# EAGLE design sensors Layer final (EAGLE 6.1)
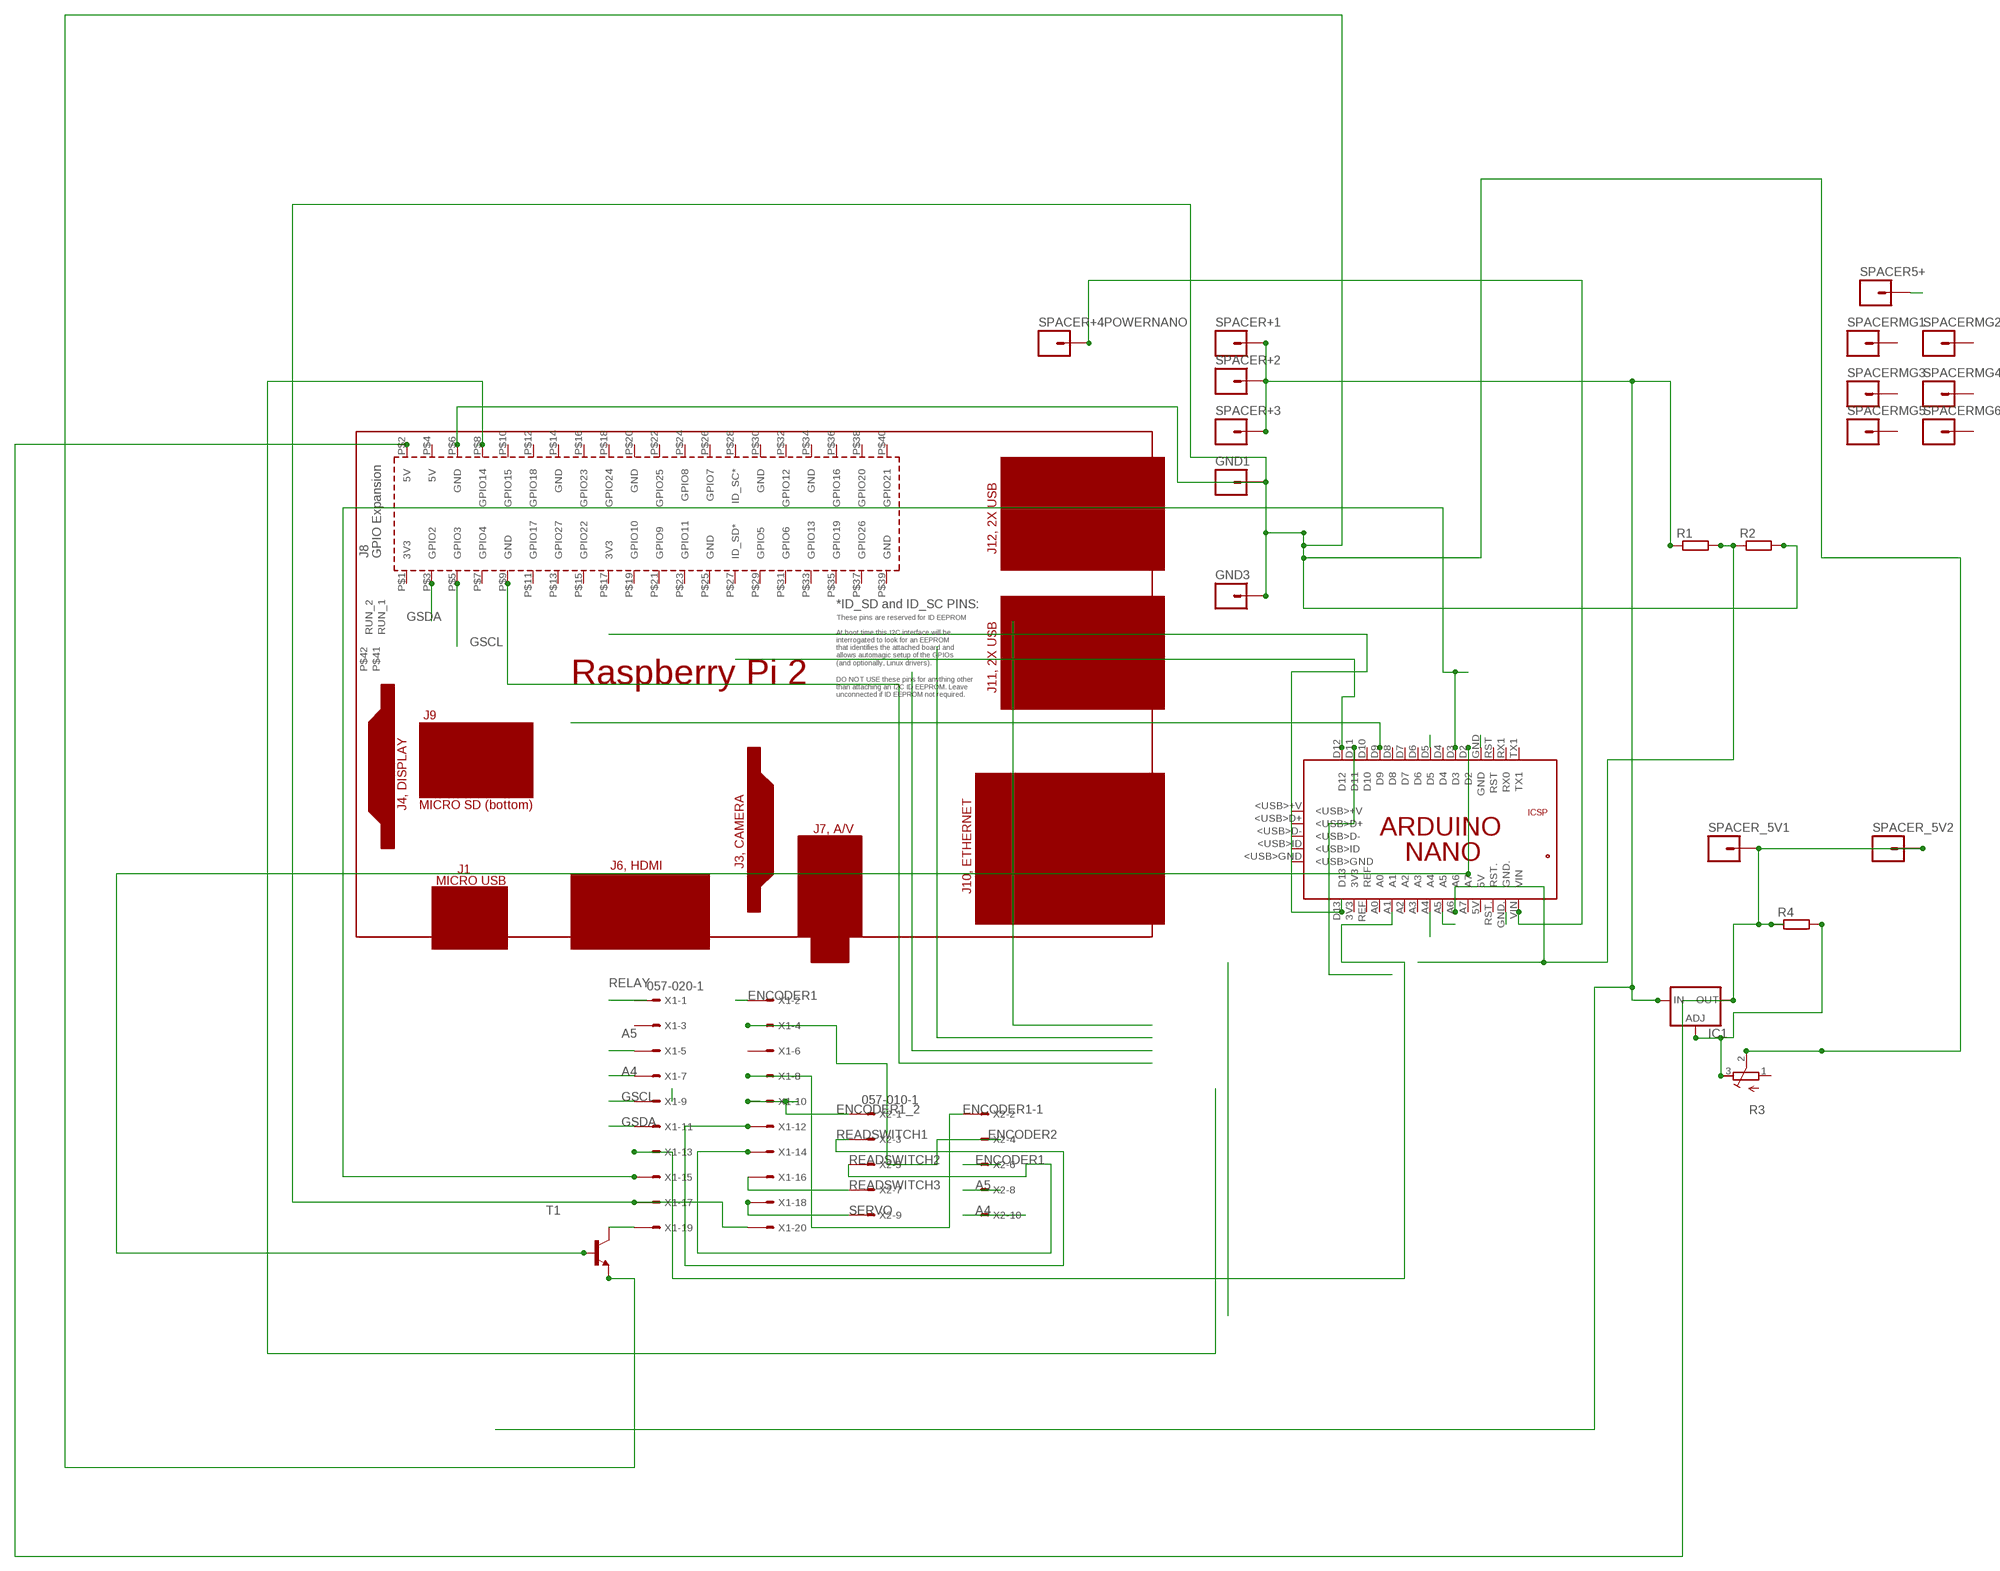
[diagram p0: schematic, sheet 1]

## Parts
GND1  M01PTH_2MM  [1X01_2MM]
GND3  M01PTH_2MM  [1X01_2MM]
IC1  LM138-TO3  [TO3-K02]
PCB1  RPI2  [RPI2]
PCB2  ARDUINO_NANO  [ARDUINO_NANO]
R1  R-EU_0207/10  [0207/10]
R2  R-EU_0207/10  [0207/10]
R3  R-TRIMM64W  [RTRIM64W]
R4  R-EU_0207/10  [0207/10]
SPACER5+  M01PTH_2MM  [1X01_2MM]
SPACER+1  M01PTH_2MM  [1X01_2MM]
SPACER+2  M01PTH_2MM  [1X01_2MM]
SPACER+3  M01PTH_2MM  [1X01_2MM]
SPACER+4POWERNANO  M01PTH_2MM  [1X01_2MM]
SPACER_5V1  M01PTH_2MM  [1X01_2MM]
SPACER_5V2  M01PTH_2MM  [1X01_2MM]
SPACERMG1  M01PTH_2MM  [1X01_2MM]
SPACERMG2  M01PTH_2MM  [1X01_2MM]
SPACERMG3  M01PTH_2MM  [1X01_2MM]
SPACERMG4  M01PTH_2MM  [1X01_2MM]
SPACERMG5  M01PTH_2MM  [1X01_2MM]
SPACERMG6  M01PTH_2MM  [1X01_2MM]
T1  BC547-NPN-TO92-CBE  [TO92-CBE]
X1  057-020-1  [057-020-1]
X2  057-010-1  [057-010-1]

## Nets
5V: IC1.3(OUT) PCB1.P$2(5V) R4.1 SPACER5+.1 SPACER_5V1.1 SPACER_5V2.1
A4: PCB2.A4 X1.7 X2.10
A5: PCB2.A5 X1.5 X2.8
ENCODER1: X1.2 X2.6
ENCODER1-1: X1.8 X2.2
ENCODER1_2: X1.10 X2.1
ENCODER2: X1.4 X2.4
GND: GND1.1 GND3.1 PCB1.P$6(GND) PCB2.GND PCB2.GND. R2.2 R3.2(S) T1.E X1.17 X1.20
GSCL: PCB1.P$5(GPIO3) X1.9
GSDA: PCB1.P$3(GPIO2) X1.11
N$1: PCB2.D2 T1.B
N$3: PCB2.D12
N$4: PCB2.D13
N$5: PCB2.D11
N$6: PCB2.D9
N$7: PCB2.A1 X1.13
N$9: T1.C X1.19
N$14: IC1.1(IN) R1.1 SPACER+1.1 SPACER+2.1 SPACER+3.1
N$15: PCB2.VIN SPACER+4POWERNANO.1
N$16: PCB2.A6 R1.2 R2.1
N$21: PCB1.P$9(GND)
N$24: PCB2.D3 X1.15
N$27: PCB1.P$8(GPIO14)
N$32: IC1.2(ADJ) R3.3(A) R4.2
READSWITCH1: X1.12 X2.3
READSWITCH2: X1.14 X2.5
READSWITCH3: X1.16 X2.7
RELAY: PCB2.D5 X1.1
SERVO: X1.18 X2.9
Unconnected: PCB1.P$1(3V3) PCB1.P$4(5V) PCB1.P$7(GPIO4) PCB1.P$10(GPIO15) PCB1.P$11(GPIO17) PCB1.P$12(GPIO18) PCB1.P$13(GPIO27) PCB1.P$14(GND) PCB1.P$15(GPIO22) PCB1.P$16(GPIO23) PCB1.P$17(3V3) PCB1.P$18(GPIO24) PCB1.P$19(GPIO10) PCB1.P$20(GND) PCB1.P$21(GPIO9) PCB1.P$22(GPIO25) PCB1.P$23(GPIO11) PCB1.P$24(GPIO8) PCB1.P$25(GND) PCB1.P$26(GPIO7) PCB1.P$27(ID_SD*) PCB1.P$28(ID_SC*) PCB1.P$29(GPIO5) PCB1.P$30(GND) PCB1.P$31(GPIO6) PCB1.P$32(GPIO12) PCB1.P$33(GPIO13) PCB1.P$34(GND) PCB1.P$35(GPIO19) PCB1.P$36(GPIO16) PCB1.P$37(GPIO26) PCB1.P$38(GPIO20) PCB1.P$39(GND) PCB1.P$40(GPIO21) PCB1.P$41(RUN_1) PCB1.P$42(RUN_2) PCB2.3V3 PCB2.5V PCB2.5V. PCB2.<USB>+V PCB2.<USB>D+ PCB2.<USB>D- PCB2.<USB>GND PCB2.<USB>ID PCB2.A0 PCB2.A2 PCB2.A3 PCB2.A7 PCB2.D4 PCB2.D6 PCB2.D7 PCB2.D8 PCB2.D10 PCB2.GND_ PCB2.MISO PCB2.MOSI PCB2.REF PCB2.RESET.. PCB2.RST PCB2.RST. PCB2.RX1(RX0) PCB2.SCK PCB2.TX1 R3.1(E) SPACERMG1.1 SPACERMG2.1 SPACERMG3.1 SPACERMG4.1 SPACERMG5.1 SPACERMG6.1 X1.3 X1.6

## Library data of the parts
GND1 GND3 SPACER5+ SPACER+1-SPACER+3 SPACER+4POWERNANO SPACER_5V1 SPACER_5V2 SPACERMG1-SPACERMG6 = SparkFun-Connectors:M01: Header 1 Standard 1-pin 0.1" header. Use with straight break away headers (SKU : PRT-00116), right angle break away headers (PRT-00553), swiss pins (PRT-00743), machine pins (PRT-00117), and female headers (PRT-00115).
IC1 = v-reg:LM138-TO3: VOLTAGE REGULATOR
PCB1 = e14_Rpi2_RevA:RPI2: Device for Raspberry Pi 2 board created by www.element14.com More information and support community is available at http://www.element14.com/community/community/raspberry-pi/raspberrypi2
PCB2 = E14_Arduino_revB:ARDUINO_NANO: Device for representing an Arduino Nano board with a footprint in an EAGLE design. Created by Dave Young for Element14. More EAGLE documentation at: http://www.element14.com/community/community/knode/cadsoft_eagle
R1 R2 R4 = resistor:R-EU_: RESISTOR, European symbol
R3 = resistor:R-TRIMM: Trimm resistor
T1 = transistor:*-NPN-: NPN Transistror BF959 corrected 2008.03.06
X1 = con-panduit:057-020-: CONNECTOR 20-pin series 057 contact pc board low profile headers; OC_FARNELL: unknown; OC_NEWARK: unknown
X2 = con-panduit:057-010-: CONNECTOR 10-pin series 057 contact pc board low profile headers; OC_FARNELL: unknown; OC_NEWARK: unknown

## Board
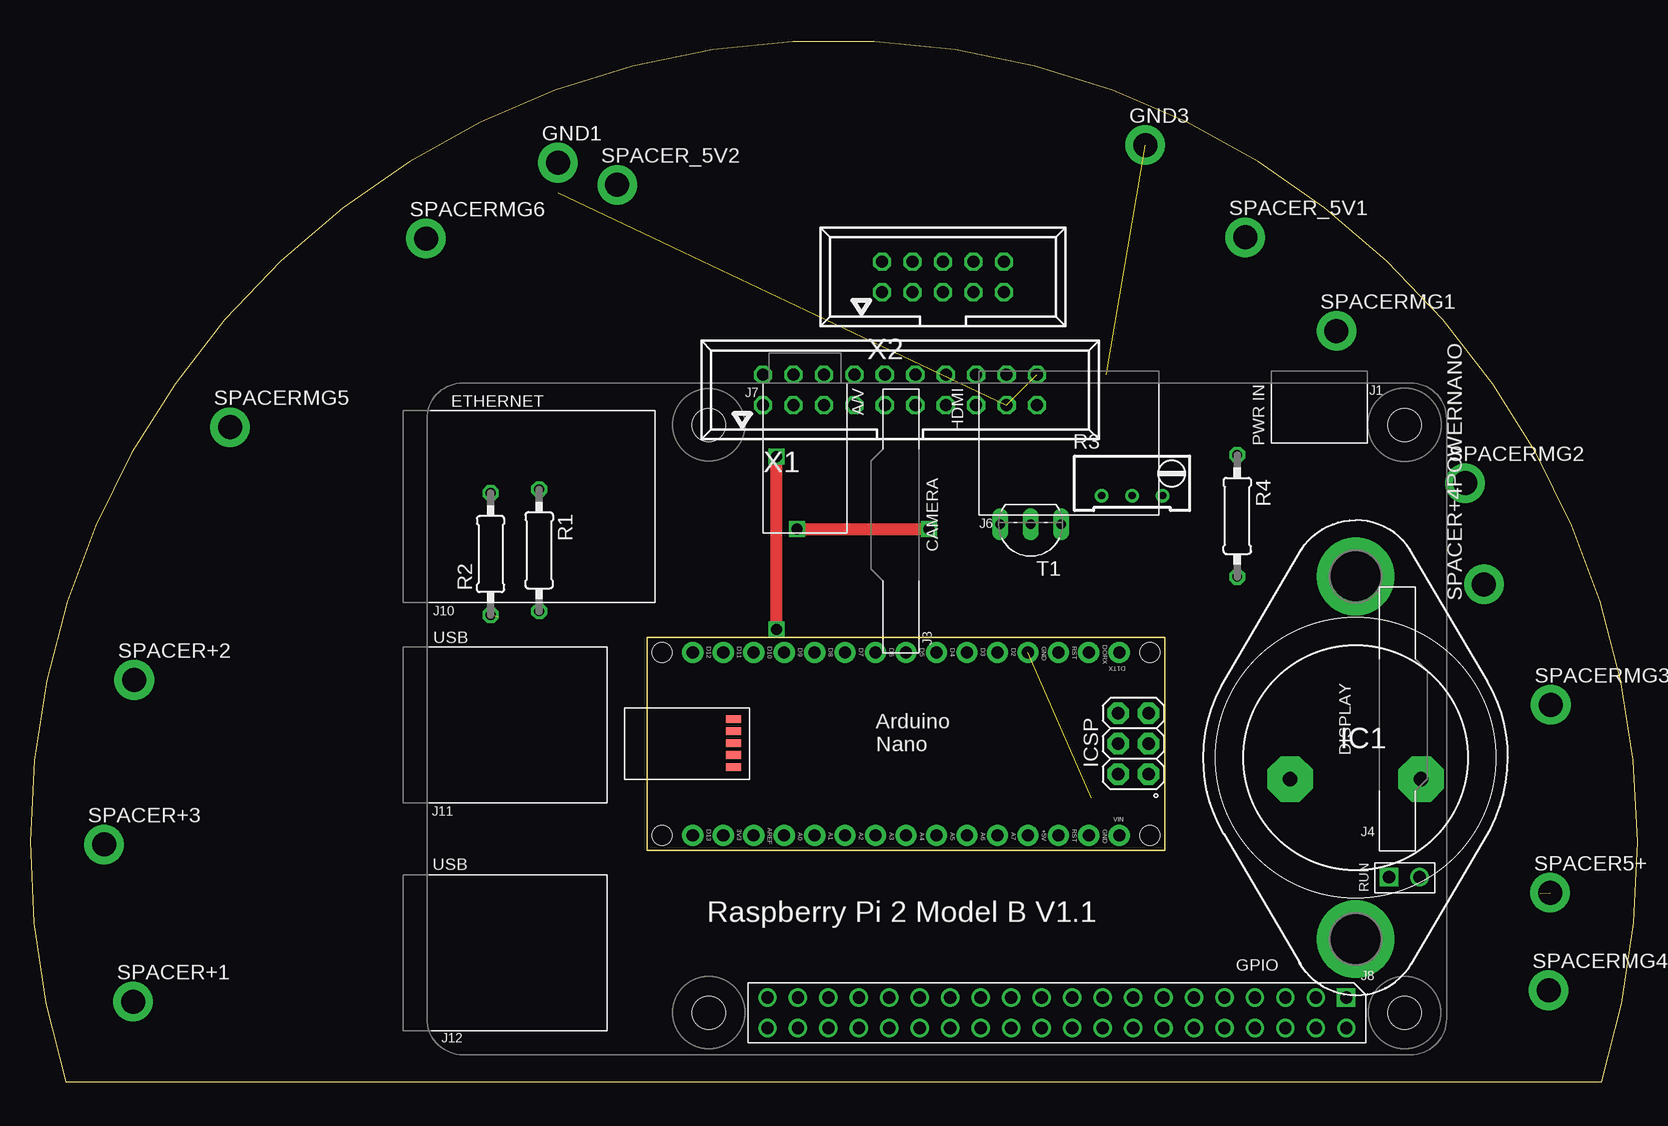
[diagram p1: board, top side]
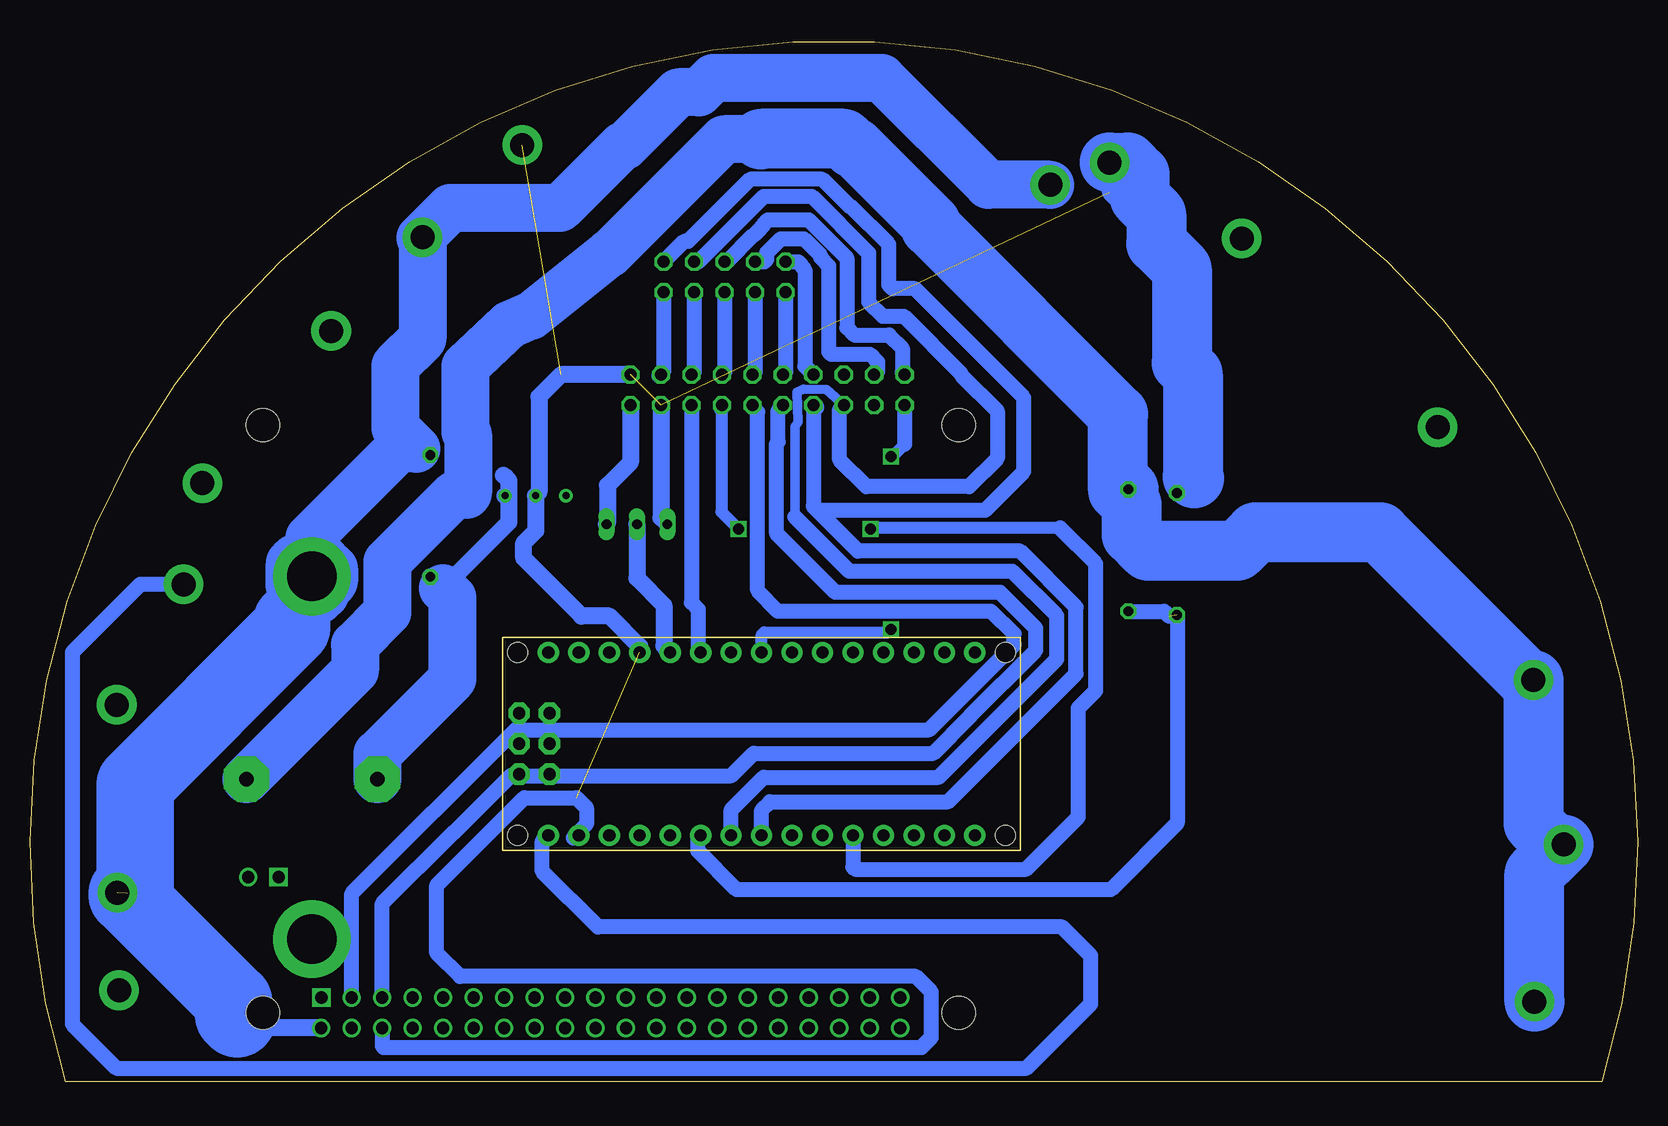
[diagram p2: board, bottom side, seen from below]

Size 134.01 x 86.73 mm. Coordinates in mm from the lower left corner, seen from the top.
Outline: 131.01,0 arc214 3,0 131.01,0
Copper layers (1*16): Top 0.035mm / dielectric 1.5mm / Bottom 0.035mm
Design rules: minimum track width 10mil, minimum drill 24mil, track to track 8mil, track to pad 8mil, pad to pad 8mil, via to via 8mil, smd to smd 8mil, copper to edge 40mil, drill to drill 8mil, minimum pad ring 10mil, minimum via ring 8mil, stop-mask expansion 4mil, vias tented up to drill 0mil, thermal gap 10mil

### Footprints (pad centres in the part's own frame; a part is rotated, then mirrored left to right if it is on the bottom)
1X01_2MM = drill 2 pad 3.302: 1 0,0
TO3-K02 = drill 1.194 pad 3.81 octagon: 1 -1.778,-5.461; 2 -1.778,5.461 | drill 4.115 pad 6.477: 3 15.113,0; 3@ -15.113,0
RPI2 = drill 1.016 square: P$1 8.37,51.23; P$41 4.8,41.2 | drill 1.016: P$2 8.357,53.772; P$3 10.897,51.232; P$4 10.897,53.772; P$5 13.437,51.232; P$6 13.437,53.772; P$7 15.977,51.232; P$8 15.977,53.772; P$9 18.517,51.232; P$10 18.517,53.772; P$11 21.057,51.232; P$12 21.057,53.772; P$13 23.597,51.232; P$14 23.597,53.772; P$15 26.137,51.232; P$16 26.137,53.772; P$17 28.677,51.232; P$18 28.677,53.772; P$19 31.217,51.232; P$20 31.217,53.772; P$21 33.757,51.232; P$22 33.757,53.772; P$23 36.297,51.232; P$24 36.297,53.772; P$25 38.837,51.232; P$26 38.837,53.772; P$27 41.377,51.232; P$28 41.377,53.772; P$29 43.917,51.232; P$30 43.917,53.772; P$31 46.457,51.232; P$32 46.457,53.772; P$33 48.997,51.232; P$34 48.997,53.772; P$35 51.537,51.232; P$36 51.537,53.772; P$37 54.077,51.232; P$38 54.077,53.772; P$39 56.617,51.232; P$40 56.617,53.772; P$42 2.26,41.2 | hole 2.75: 3.5,3.5; 61.5,3.5; 3.5,52.5; 61.5,52.5
ARDUINO_NANO = drill 1.016 pad 1.778: 3V3 6.35,1.27; 5V 31.75,1.27; A0 11.43,1.27; A1 13.97,1.27; A2 16.51,1.27; A3 19.05,1.27; A4 21.59,1.27; A5 24.13,1.27; A6 26.67,1.27; A7 29.21,1.27; D2 29.21,16.51; D3 26.67,16.51; D4 24.13,16.51; D5 21.59,16.51; D6 19.05,16.51; D7 16.51,16.51; D8 13.97,16.51; D9 11.43,16.51; D10 8.89,16.51; D11 6.35,16.51; D12 3.81,16.51; D13 3.81,1.27; GND 31.75,16.51; GND. 36.83,1.27; REF 8.89,1.27; RST 34.29,16.51; RST. 34.29,1.27; RX1 36.83,16.51; TX1 39.37,16.51; VIN 39.37,1.27 | drill 1.016 pad 1.778 octagon: 5V. 39.268,6.375; GND_ 39.268,11.455; MISO 41.808,6.375; MOSI 39.268,8.915; RESET.. 41.808,11.455; SCK 41.808,8.915 | smd 1.27 x 0.635: <USB>+V 7.214,10.947; <USB>D+ 7.214,9.957; <USB>D- 7.214,8.941; <USB>GND 7.214,6.96; <USB>ID 7.214,7.976 | hole 1.651: 1.27,1.27; 1.27,16.51; 41.91,16.51; 41.91,1.27
0207/10 = drill 0.813 octagon: 1 -5.08,0; 2 5.08,0
RTRIM64W = drill 0.61: 1 1.27,-2.54; 2 1.27,0; 3 1.27,2.54
TO92-CBE = drill 0.813 long: B 0,0; C -2.54,0; E 2.54,0
057-020-1 = drill 1 octagon: 1 -11.43,-1.27; 2 -11.43,1.27; 3 -8.89,-1.27; 4 -8.89,1.27; 5 -6.35,-1.27; 6 -6.35,1.27; 7 -3.81,-1.27; 8 -3.81,1.27; 9 -1.27,-1.27; 10 -1.27,1.27; 11 1.27,-1.27; 12 1.27,1.27; 13 3.81,-1.27; 14 3.81,1.27; 15 6.35,-1.27; 16 6.35,1.27; 17 8.89,-1.27; 18 8.89,1.27; 19 11.43,-1.27; 20 11.43,1.27
057-010-1 = drill 1 octagon: 1 -5.08,-1.27; 2 -5.08,1.27; 3 -2.54,-1.27; 4 -2.54,1.27; 5 0,-1.27; 6 0,1.27; 7 2.54,-1.27; 8 2.54,1.27; 9 5.08,-1.27; 10 5.08,1.27

### Placement (x,y rotation side)
GND1  44.01,76.64 0 top
GND3  92.97,78.11 0 top
IC1  110.5,27.03 90 top
PCB1  118.09,58.27 180 top
PCB2  51.43,19.29 0 top
R1  42.44,44.32 270 top
R2  38.39,44.01 90 top
R3  91.86,50.15 270 top
R4  100.63,47.19 270 top
SPACER5+  126.72,15.77 0 top
SPACER+1  8.59,6.7 0 top
SPACER+2  8.68,33.51 0 top
SPACER+3  6.17,19.79 0 top
SPACER+4POWERNANO  121.2,41.49 90 top
SPACER_5V1  101.29,70.42 0 top
SPACER_5V2  48.95,74.79 0 top
SPACERMG1  108.9,62.61 0 top
SPACERMG2  119.63,49.92 0 top
SPACERMG3  126.77,31.44 0 top
SPACERMG4  126.58,7.64 0 top
SPACERMG5  16.67,54.59 0 top
SPACERMG6  33,70.31 0 top
T1  83.41,46.5 180 top
X1  72.52,57.69 0 top
X2  76.1,67.11 0 top

### Tracks (layer width: path | path; a pad name or v marks a point on that pad's centre or on a via)
5V  (1 unrouted)
  Bottom 1.422: 101.81,52.8 102.79,52.8 103.21,52.38 100.74,52.38 R4.1 103.94,52.27 112.18,44.03 112.18,38.35 | PCB1.P$2 115.62,4.5 117.02,5.9
  Bottom 4: 108.81,41.52 108.85,41.52 108.85,41.56 108.67,41.74 108.67,42.81 109.43,43.57 110.46,43.57 110.55,43.66 111.97,43.66 112.33,43.3 112.33,42.99 112.37,42.95 112.37,41.47 111.48,40.58 111.48,40.14 111.44,40.18 109.88,40.18 109.44,40.62 109.44,43.51 110.5,42.45 IC1.3 110.73,42.38 110.73,45.36 103.29,52.8 101.81,52.8 103.55,54.54 103.55,59.71 101.29,61.97 SPACER_5V1.1 101.36,70.35 101.47,70.35 98.97,72.85 89.82,72.85 84.62,78.05 84.42,78.05 79.96,82.51 78.25,82.51 77.06,83.7 63.02,83.7 54.11,74.79 SPACER_5V2.1
  Bottom 6.452: 112.18,38.35 112.18,37.88 125.25,24.81 125.25,16.39 125.9,15.74 125.9,15.54 117.02,6.66 117.02,5.9 117.02,5.56 116.74,5.28
A4
  Bottom 1.27: PCB2.A4 73.02,22.67 72.33,23.36 57.47,23.36 46.8,34.03 46.8,39.59 51.46,44.25 64.99,44.25 68.66,47.92 68.66,56.37 X1.7 68.71,48.05 68.33,47.67 54.37,47.67 51.15,50.89 51.15,57.05 60.23,66.13 62.1,66.13 62.41,66.44 62.41,69.83 65.59,73.01 65.71,73.01 67.95,75.25 73.98,75.25 79.14,70.09 79.47,70.09 X2.10
  Bottom 1.422: 68.52,56.23 X1.7
A5
  Bottom 0.8: 70.24,47.11 70.24,54.64 69.99,55 70.08,57.5 69.54,57.76 67.61,57.71 X1.5
  Bottom 1.27: PCB2.A5 75.56,22.68 72.84,25.4 58.27,25.4 48.41,35.26 48.41,38.87 52.11,42.57 65.7,42.57 70.24,47.11 | X2.8 78.28,68.38 72.83,73.83 68.82,73.83 64.1,69.11 64.1,65.02 62.91,63.83 61.17,63.83 56.38,59.04 56.38,58.95 53.36,55.93 53.36,51.99 55.72,49.63 64.28,49.63 66.51,51.86 66.51,56.08 X1.5
ENCODER1
  Bottom 1.27: X2.6 75.92,68.38 73.68,70.62 73.62,70.62 73.06,71.18 73.06,71.21 72.93,71.34 72.93,71.42 72.7,71.65 72.7,71.67 72.49,71.88 69.09,71.88 65.9,68.69 65.9,62.87 65.3,62.27 62.39,62.27 61.28,61.16 61.28,59.15 X1.2
ENCODER1-1
  Bottom 1.27: X2.2 69.98,68.38 69.69,68.09 69.69,68 69.41,67.72 69.41,59.66 X1.8
ENCODER1_2
  Bottom 1.27: X2.1 71.02,59.19 X1.10
ENCODER2
  Bottom 1.27: X2.4 72.78,68.38 72.57,68.59 72.57,69.14 71.42,70.29 69.5,70.29 68.08,68.87 68.08,68.68 67.43,68.03 67.43,60.88 67.22,60.67 64,60.67 63.35,60.02 63.35,59.24 X1.4
GND  (4 unrouted)
  Bottom 1.27: R2.2 37.14,50.34 37.14,59.14 38.25,60.25 38.25,68.36 44.01,74.12 GND1.1 | PCB1.P$6 104.65,2.99 104.54,2.88 59.69,2.88 58.86,3.71 58.86,7.5 60.16,8.8 98.16,8.8 100.1,10.74 100.1,16.4 92.8,23.7 88.46,23.7 87.62,22.86 87.62,21.48 88.73,20.37 88.45,20.37 PCB2.GND. 88.49,20.56 88.71,20.34
  Bottom 1.422: PCB2.GND 83.18,36.31 85.71,38.84 88.03,38.84 92.85,43.66 92.85,44.92 91.84,45.93 91.86,45.95 R3.2 91.57,49.17 91.57,57.12 89.73,58.96 X1.20 | X1.17 81.41,47.04 T1.E
  Bottom 5: GND1.1 42.5,76.64 41.51,75.65 41.51,73.73 40.11,72.33 40.11,69.91 37.99,67.79 37.99,59.94 37.07,59.02 37.07,50.43 36.96,50.32
GSCL
  Bottom 1.27: PCB1.P$5 104.65,14.88 98.75,20.78 98.71,20.78 93.96,25.53 75.55,25.53 73.69,27.39 58.7,27.39 55.63,30.46 55.63,30.51 50.15,35.99 50.15,37.82 53.14,40.81 66.87,40.81 71.77,45.71 71.77,53.25 71.64,53.38 71.64,56 71.32,56.32 71.32,56.35 X1.9
GSDA
  Bottom 1.27: PCB1.P$3 107.19,15.7 93.53,29.36 59.06,29.36 51.97,36.45 51.97,37.36 53.92,39.23 71.67,39.23 73.34,40.98 73.34,55.86 73.78,56.3 X1.11
N$1
  Bottom 1.422: T1.B 83.41,42 81.15,39.74 81.15,36.36 80.66,35.87 80.66,35.82 PCB2.D2
N$7  (via drill 0.9 pad 1.02)
  Top 1.016: v63.94,46.1 v74.94,46.1
  Bottom 1.016: 48.13,46.18 63.86,46.18 v63.94,46.1 | 76.37,56.1 76.37,47.53 v74.94,46.1
  Bottom 1.27: X1.13 76.33,56.14 76.37,56.1 | PCB2.A1 65.4,17.9 65.23,17.73 50.97,17.73 46.62,22.08 46.62,31.16 45.16,32.62 45.16,43.21 48.13,46.18
N$9
  Bottom 1.422: X1.19 83.95,51.65 85.87,49.73 85.87,46.58 T1.C
N$14
  Bottom 1.27: 21.48,45.81 20.62,45.81 8.18,33.37
  Bottom 4: 73.1,78.59 76.15,78.59 85.66,69.08 85.75,69.08 92.25,63.87 94.05,63.11 97.73,59.65 97.73,54.2 97.49,54 97.49,49.08 97.6,48.97 98.6,48.97 104.22,43.35 104.22,39.14 106.91,36.45 106.91,34.3 IC1.1
  Bottom 5: SPACER+1.1 8.59,17.37 6.54,19.43 | 6.54,19.43 SPACER+3.1 | 6.54,19.43 8.68,21.57 SPACER+2.1 9.18,33.51 21.48,45.81 31.83,45.81 33.36,44.28 40.8,44.28 42.15,45.63 42.15,48.13 43.31,49.29 | 43.31,49.29 42.55,49.29 R1.1 | 43.31,49.29 43.31,55.65 58.91,71.25 58.91,71.57 65.22,77.88 65.41,77.88 66.15,78.62 73.07,78.62 73.1,78.59
N$15
  Bottom 1.27: SPACER+4POWERNANO.1 124.8,41.49 130.48,35.81 130.48,4.81 126.81,1.14 50.94,1.14 45.57,6.51 45.57,10.52 47.97,12.92 86.65,12.92 91.3,17.57 91.3,20.06 PCB2.VIN
N$16  (1 unrouted)
  Bottom 1.27: R1.2 39.46,39.24 39.03,38.81 | R2.1 38.39,38.83 38.37,38.81 38.37,21.58 43.92,16.03 75.1,16.03 78.32,19.25 78.32,20.34 PCB2.A6
N$24
  Bottom 1.27: X1.15 78.87,39.97 78.3,39.4 78.3,36 PCB2.D3
N$32
  Bottom 1.422: 94.54,50.58 94.09,50.13 94.09,49.03 | 94.09,49.03 94.09,46.65 99.41,41.34 | 99.41,41.34 99.58,41.16 | R3.3 94.24,48.88 94.09,49.03 | R4.2 100.18,42.11 99.41,41.34
  Bottom 4: IC1.2 105.04,27.35 98.78,33.61 98.78,40.36 99.58,41.16
READSWITCH1
  Bottom 1.27: X2.3 73.56,59.19 X1.12
READSWITCH2
  Bottom 1.27: X2.5 76.1,59.19 X1.14
READSWITCH3
  Bottom 1.27: X2.7 78.64,59.19 X1.16
RELAY  (via drill 0.9 pad 1.02)
  Top 1.016: v62.23,37.72 v62.23,52.14
  Bottom 1.016: PCB2.D5 73.02,37.27 72.81,37.48 62.47,37.48 v62.23,37.72 | v62.23,52.14 62.23,52.27 61.97,52.27 61.09,53.15
  Bottom 1.27: X1.1 61.09,53.15
SERVO
  Bottom 1.27: X2.9 81.18,59.29 81.6,58.87 81.32,58.87 81.26,58.93 81.38,58.93 X1.18